# Altium schematic sheet Sheet1.SchDoc
size A; SheetNumber: 1; SheetTotal: 1
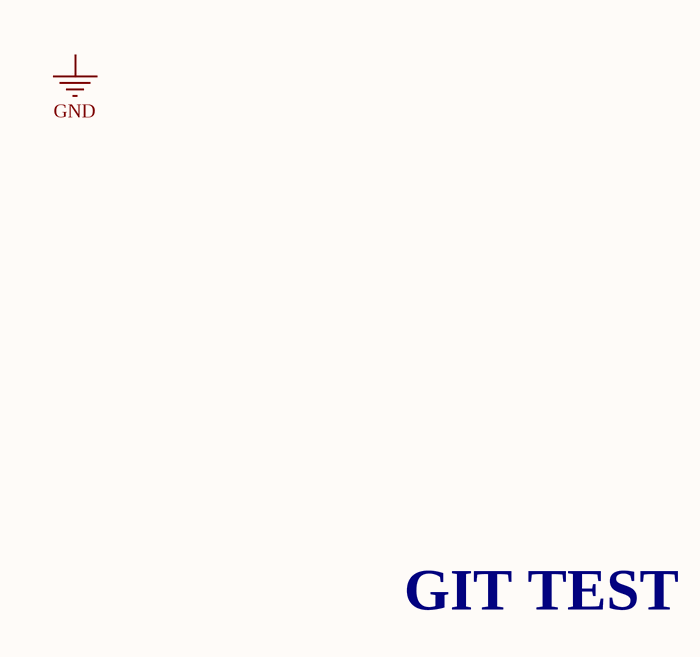
[diagram p0: Sheet1.SchDoc]

## Notes on the sheet
- GIT TEST
- Labels drawn without touching a wire or pin: GND